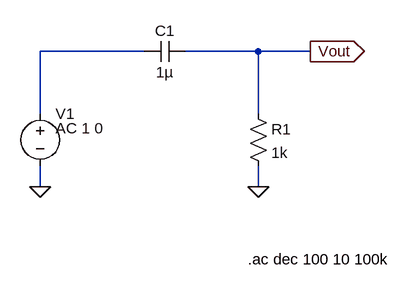
[diagram p0: schematic RC_high_pass.asc]
RC_high_pass.asc, the LTspice schematic file:
Version 4
SHEET 1 880 680
WIRE 288 160 128 160
WIRE 464 160 352 160
WIRE 544 160 464 160
WIRE 128 256 128 160
WIRE 464 256 464 160
WIRE 128 368 128 336
WIRE 464 368 464 336
FLAG 128 368 0
FLAG 464 368 0
FLAG 544 160 Vout
IOPIN 544 160 Out
SYMBOL Voltage 128 240 R0
WINDOW 123 24 38 Left 2
SYMATTR InstName V1
SYMATTR Value ""
SYMATTR Value2 AC 1 0
SYMBOL Cap 352 144 R90
WINDOW 0 0 32 VBottom 2
WINDOW 3 32 32 VTop 2
SYMATTR InstName C1
SYMATTR Value 1µ
SYMBOL Res 448 240 R0
SYMATTR InstName R1
SYMATTR Value 1k
TEXT 448 480 Left 2 !.ac dec 100 10 100k

The netlist it stands for:
* RC_high_pass.asc
V1 N001 0 AC 1 0
C1 Vout N001 1µ
R1 Vout 0 1k
.ac dec 100 10 100k
.backanno
.end